# EAGLE design nisetoro_wsc_adapter_v2 (EAGLE 9.6.2)
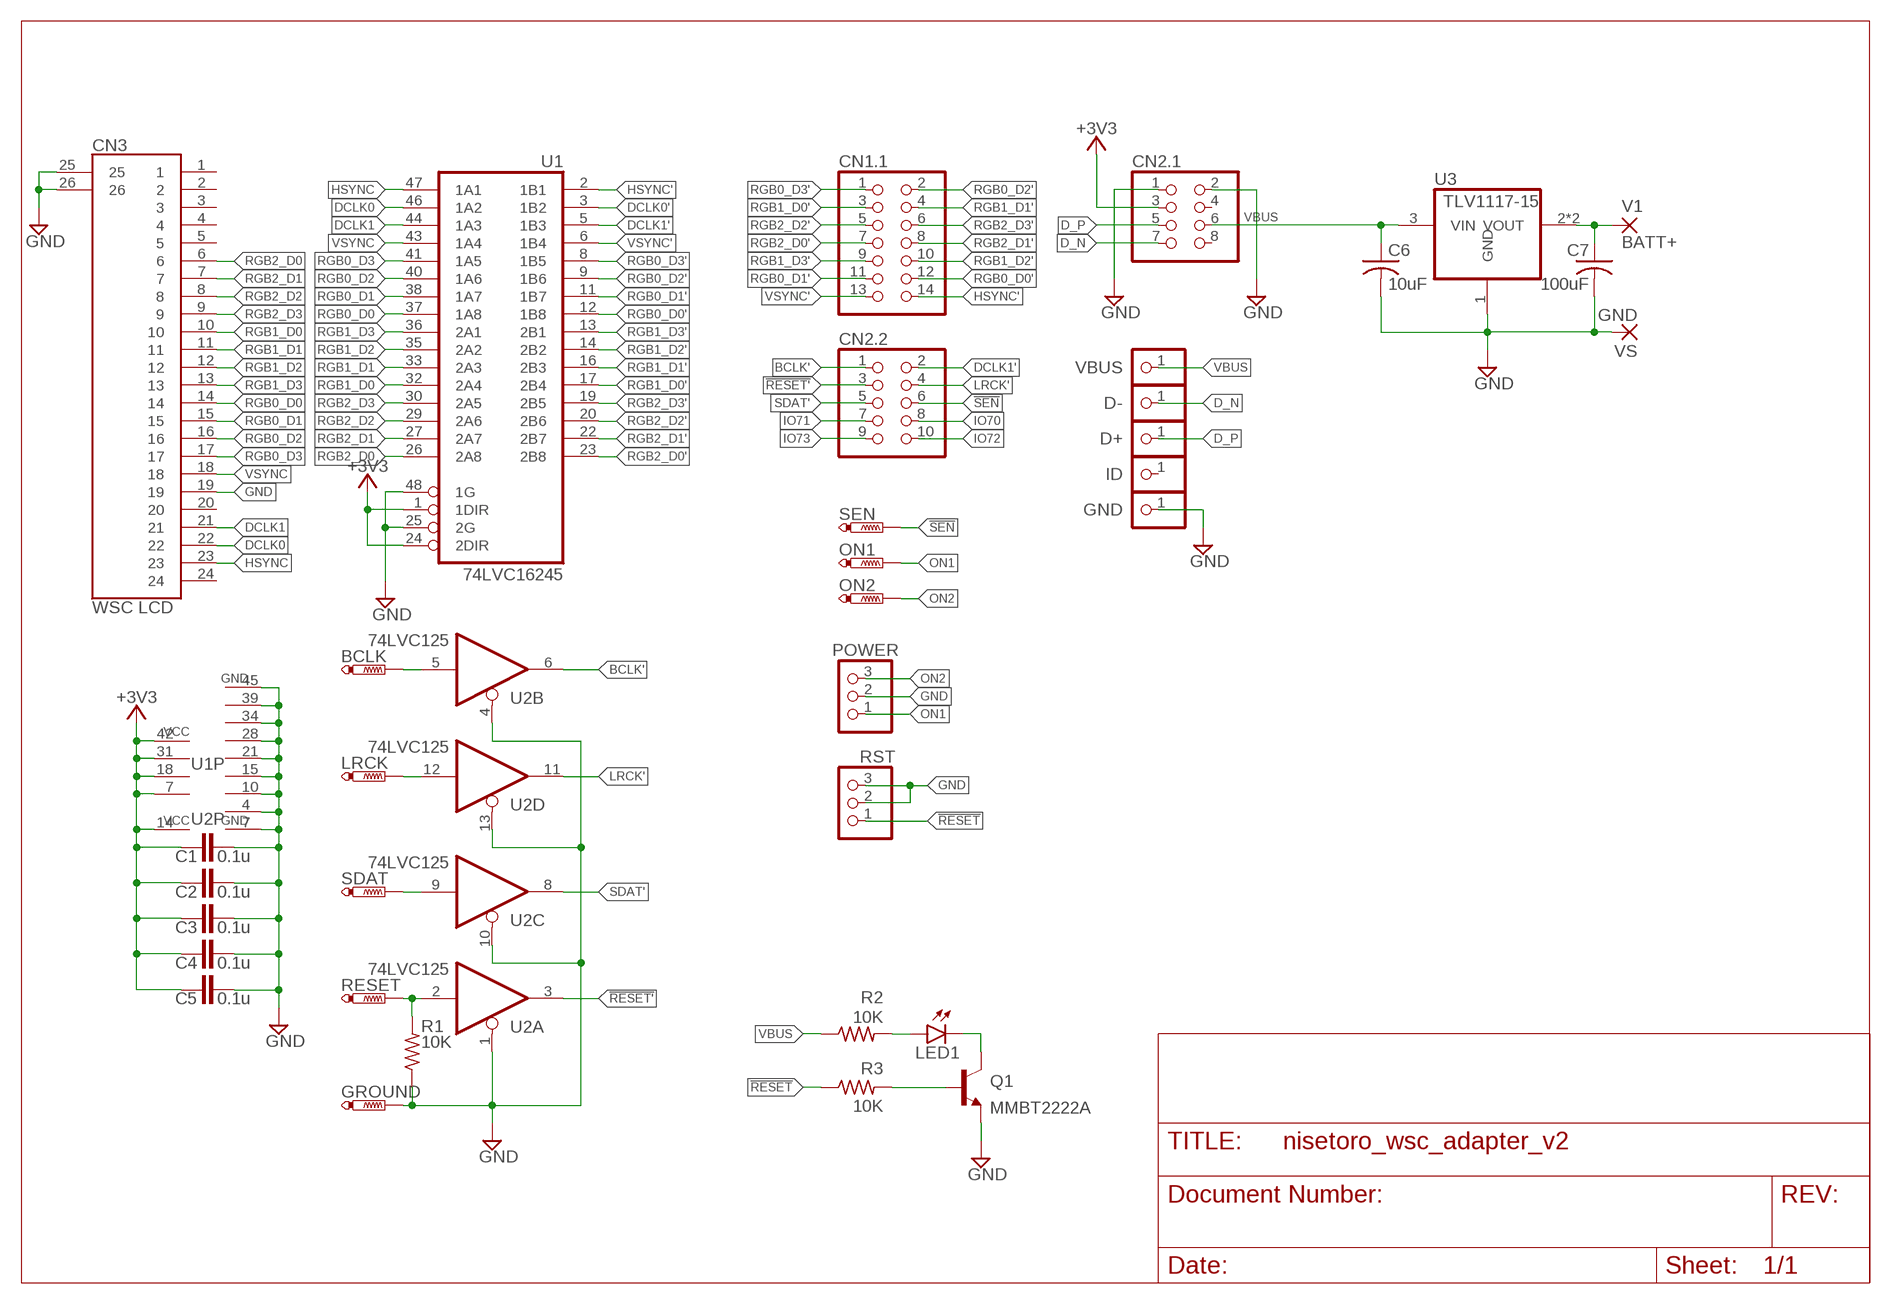
[diagram p0: schematic, sheet 1]

## Parts
BCLK  PTR1B1,27  [B1,27]
C1  0.1u  C-EUC0603  [C0603]
C2  0.1u  C-EUC0603  [C0603]
C3  0.1u  C-EUC0603  [C0603]
C4  0.1u  C-EUC0603  [C0603]
C5  0.1u  C-EUC0603  [C0603]
C6  10uF  C-USC1210  [C1210]
C7  100uF  C-USC1210  [C1210]
CN1.1  PINHD-2X7  [2X07]
CN2.1  PINHD-2X4  [2X04]
CN2.2  PINHD-2X5  [2X05]
CN3  WSC LCD  68712414022/R  [68712414022/R]
D+  PINHD-1X1  [1X01]
D-  PINHD-1X1  [1X01]
GND  PINHD-1X1  [1X01]
GROUND  PTR1B1,27  [B1,27]
ID  PINHD-1X1  [1X01]
LED1  LEDSML0603  [SML0603]
LRCK  PTR1B1,27  [B1,27]
ON1  PTR1B1,27  [B1,27]
ON2  PTR1B1,27  [B1,27]
POWER  PINHD-1X3/ROUND  [1X03/ROUND]
Q1  MMBT2222A  2N2222SOT23  [SOT23-BEC]
R1  10K  R-US_R0603  [R0603]
R2  10K  R-US_R0603  [R0603]
R3  10K  R-US_R0603  [R0603]
RESET  PTR1B1,27  [B1,27]
RST  PINHD-1X3/ROUND  [1X03/ROUND]
SDAT  PTR1B1,27  [B1,27]
SEN  PTR1B1,27  [B1,27]
U1  74LVC16245  74AC16245DGG  [TSSOP48]
U2  74LVC125  74ABT125PW  [TSSOP14]
U3  TLV1117-15  REG1117  [SOT223]
V1  BATT+  WIREPADSMD2,54-5,08  [SMD2,54-5,08]
VBUS  PINHD-1X1  [1X01]
VS  GND  WIREPADSMD2,54-5,08  [SMD2,54-5,08]

## Nets
!RESET: R1.2 R3.1 RESET.TP RST.1 U2.2(A:I)
!RESET': CN2.2.3 U2.3(A:O)
!SEN: CN2.2.6 SEN.TP
+3V3: C1.1 C2.1 C3.1 C4.1 C5.1 CN2.1.3 U1.1(1DIR) U1.7(VCC) U1.18(VCC) U1.24(2DIR) U1.31(VCC) U1.42(VCC) U2.14(P:VCC)
BATT+: C7.1 U3.2(VOUT) U3.4(VOUT) V1.1(P)
BCLK: BCLK.TP U2.5(B:I)
BCLK': CN2.2.1 U2.6(B:O)
D_N: CN2.1.7 D-.1
D_P: CN2.1.5 D+.1
DCLK0: CN3.22 U1.46(1A2)
DCLK0': U1.3(1B2)
DCLK1: CN3.21 U1.44(1A3)
DCLK1': CN2.2.2 U1.5(1B3)
GND: C1.2 C2.2 C3.2 C4.2 C5.2 C6.2 C7.2 CN2.1.1 CN2.1.2 CN3.19 CN3.25 CN3.26 GND.1 GROUND.TP POWER.2 Q1.E R1.1 RST.2 RST.3 U1.4(GND) U1.10(GND) U1.15(GND) U1.21(GND) U1.25(2G) U1.28(GND) U1.34(GND) U1.39(GND) U1.45(GND) U1.48(1G) U2.1(A:OE) U2.4(B:OE) U2.7(P:GND) U2.10(C:OE) U2.13(D:OE) U3.1(GND) VS.1(P)
HSYNC: CN3.23 U1.47(1A1)
HSYNC': CN1.1.14 U1.2(1B1)
IO70: CN2.2.8
IO71: CN2.2.7
IO72: CN2.2.10
IO73: CN2.2.9
LRCK: LRCK.TP U2.12(D:I)
LRCK': CN2.2.4 U2.11(D:O)
N$1: LED1.A R2.2
N$2: LED1.C Q1.C
N$4: Q1.B R3.2
ON1: ON1.TP POWER.1
ON2: ON2.TP POWER.3
RGB0_D0: CN3.14 U1.37(1A8)
RGB0_D0': CN1.1.12 U1.12(1B8)
RGB0_D1: CN3.15 U1.38(1A7)
RGB0_D1': CN1.1.11 U1.11(1B7)
RGB0_D2: CN3.16 U1.40(1A6)
RGB0_D2': CN1.1.2 U1.9(1B6)
RGB0_D3: CN3.17 U1.41(1A5)
RGB0_D3': CN1.1.1 U1.8(1B5)
RGB1_D0: CN3.10 U1.32(2A4)
RGB1_D0': CN1.1.3 U1.17(2B4)
RGB1_D1: CN3.11 U1.33(2A3)
RGB1_D1': CN1.1.4 U1.16(2B3)
RGB1_D2: CN3.12 U1.35(2A2)
RGB1_D2': CN1.1.10 U1.14(2B2)
RGB1_D3: CN3.13 U1.36(2A1)
RGB1_D3': CN1.1.9 U1.13(2B1)
RGB2_D0: CN3.6 U1.26(2A8)
RGB2_D0': CN1.1.7 U1.23(2B8)
RGB2_D1: CN3.7 U1.27(2A7)
RGB2_D1': CN1.1.8 U1.22(2B7)
RGB2_D2: CN3.8 U1.29(2A6)
RGB2_D2': CN1.1.5 U1.20(2B6)
RGB2_D3: CN3.9 U1.30(2A5)
RGB2_D3': CN1.1.6 U1.19(2B5)
SDAT: SDAT.TP U2.9(C:I)
SDAT': CN2.2.5 U2.8(C:O)
VBUS: C6.1 CN2.1.6 R2.1 U3.3(VIN) VBUS.1
VSYNC: CN3.18 U1.43(1A4)
VSYNC': CN1.1.13 U1.6(1B4)
Unconnected: CN2.1.4 CN2.1.8 CN3.1 CN3.2 CN3.3 CN3.4 CN3.5 CN3.20 CN3.24 ID.1

## Library data of the parts
BCLK GROUND LRCK ON1 ON2 RESET SDAT SEN = testpad:PTR1: TEST PIN
C1-C5 = rcl:C-EU: CAPACITOR, European symbol; SPICEPREFIX: C
C6 C7 = rcl:C-US: CAPACITOR, American symbol; SPICEPREFIX: C
CN1.1 = pinhead:PINHD-2X7: PIN HEADER
CN2.1 = pinhead:PINHD-2X4: PIN HEADER
CN2.2 = pinhead:PINHD-2X5: PIN HEADER
CN3 = SamacSys_Parts:68712414022: Wurth Elektronik 687 0.5mm Pitch 24 Way Straight SMT FPC Connector Source: Datasheet <http://katalog.we-online.de/em/datasheet/68712414022.pdf>
D+ D- GND ID VBUS = pinhead:PINHD-1X1: PIN HEADER
LED1 = led:LED: LED OSRAM: - CHIPLED LG R971, LG N971, LY N971, LG Q971, LY Q971, LO R971, LY R971 LH N974, LH R974 LS Q976, LO Q976, LY Q976 LO Q996 - Hyper CHIPLED LW Q18S LB Q993, LB Q99A, LB R99A - SideLED LS A670, LO A670, LY A670, LG A670, LP A670 LB A673, LV A673, LT A673, LW A673 LH A674 LY A675 LS A676, LA A676, LO A676, LY A676, LW A676 LS A679, LY A679, LG A679 - Hyper Micro SIDELED® LS Y876, LA Y876, LO Y876, LY Y876 LT Y87S - SmartLED LW L88C, LW L88S LB L89C, LB L89S, LG L890 LS L89K, LO L89K, LY L89K LS L896, LA L896, LO L896, LY L896 - TOPLED LS T670, LO T670, LY T670, LG T670, LP T670 LSG T670, LSP T670, LSY T670, LOP T670, LYG T670 LG T671, LOG T671, LSG T671 LB T673, LV T673, LT T673, LW T673 LH T674 LS T676, LA T676, LO T676, LY T676, LB T676, LH T676, LSB T676, LW T676 LB T67C, LV T67C, LT T67C, LS T67K, LO T67K, LY T67K, LW E67C LS E67B, LA E67B, LO E67B, LY E67B, LB E67C, LV E67C, LT E67C LW T67C LS T679, LY T679, LG T679 LS T770, LO T770, LY T770, LG T770, LP T770 LB T773, LV T773, LT T773, LW T773 LH T774 LS E675, LA E675, LY E675, LS T675 LS T776, LA T776, LO T776, LY T776, LB T776 LHGB T686 LT T68C, LB T68C - Hyper Mini TOPLED® LB M676 - Mini TOPLED Santana® LG M470 LS M47K, LO M47K, LY M47K Source: http://www.osram.convergy.de LUXEON: - LUMILED® LXK2-PW12-R00, LXK2-PW12-S00, LXK2-PW14-U00, LXK2-PW14-V00 LXK2-PM12-R00, LXK2-PM12-S00, LXK2-PM14-U00 LXK2-PE12-Q00, LXK2-PE12-R00, LXK2-PE12-S00, LXK2-PE14-T00, LXK2-PE14-U00 LXK2-PB12-K00, LXK2-PB12-L00, LXK2-PB12-M00, LXK2-PB14-N00, LXK2-PB14-P00, LXK2-PB14-Q00 LXK2-PR12-L00, LXK2-PR12-M00, LXK2-PR14-Q00, LXK2-PR14-R00 LXK2-PD12-Q00, LXK2-PD12-R00, LXK2-PD12-S00 LXK2-PH12-R00, LXK2-PH12-S00 LXK2-PL12-P00, LXK2-PL12-Q00, LXK2-PL12-R00 Source: www.luxeon.com KINGBRIGHT: KA-3528ASYC Source: www.kingbright.com
POWER RST = pinhead:PINHD-1X3: PIN HEADER
Q1 = transistor-npn:2N2222*: NPN Transistor
R1-R3 = rcl:R-US_: RESISTOR, American symbol; SPICEPREFIX: R
U1 = 74ac-logic:74AC16245: 16-bit BUS TRANSCEIVER, 3-state
U2 = 74xx-eu:74*125: Quad bus BUFFER, 3-state
U3 = burr-brown:REG1117: 800mA and 1A Low Dropout (LDO) Positive Regulator 1.8V, 2.5V, 2.85V, 3.3V, 5V, and Adj; MPN: REG1117; OC_FARNELL: 1097566; OC_NEWARK: 14P6981
V1 VS = wirepad:WIREPAD: Wire PAD connect wire on PCB

## Board
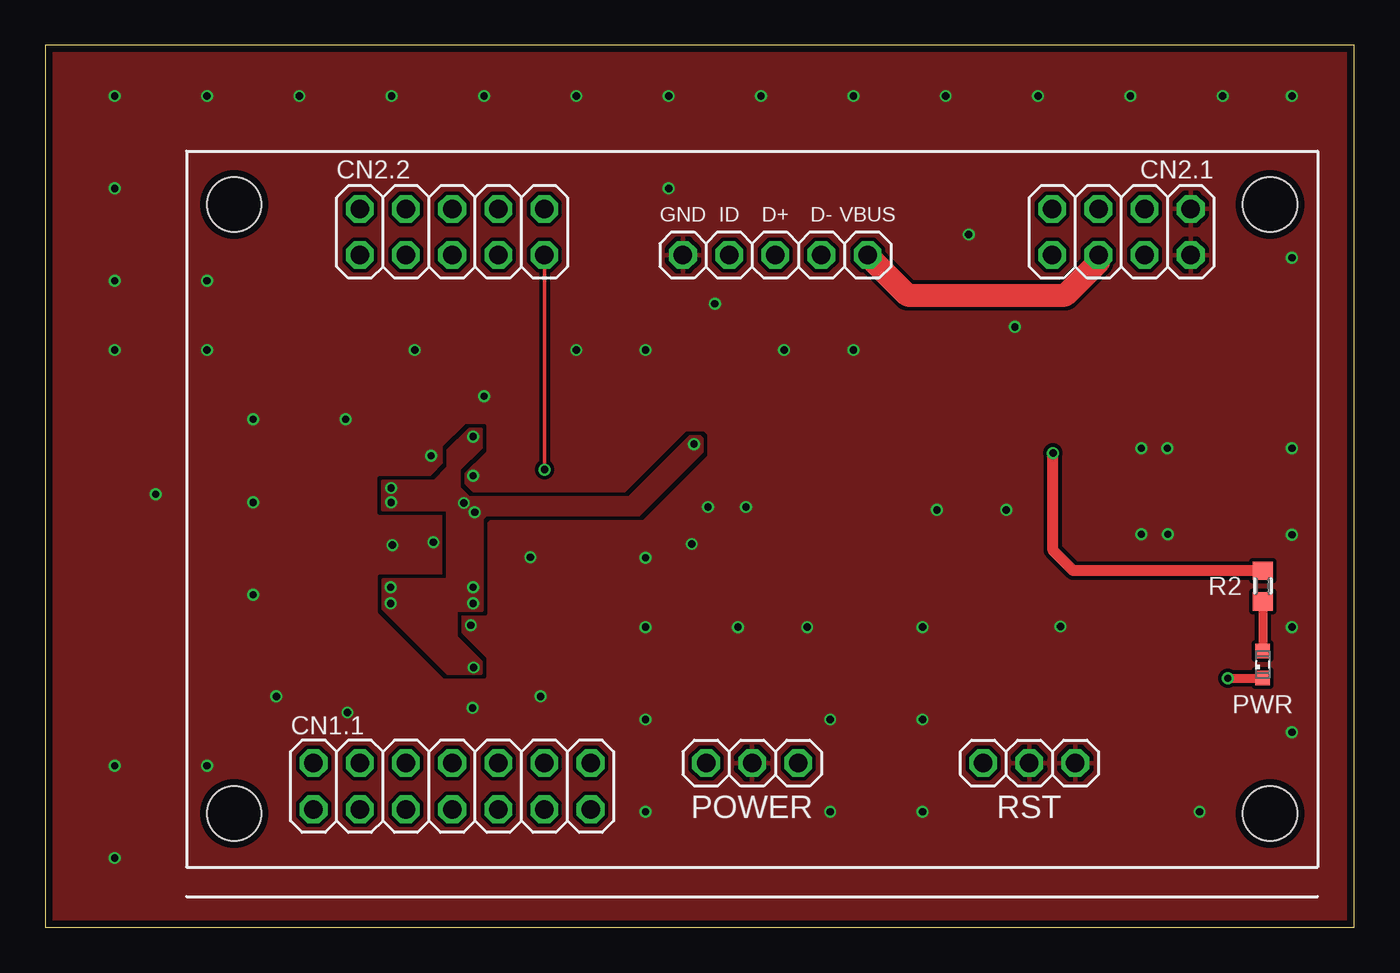
[diagram p1: board, top side]
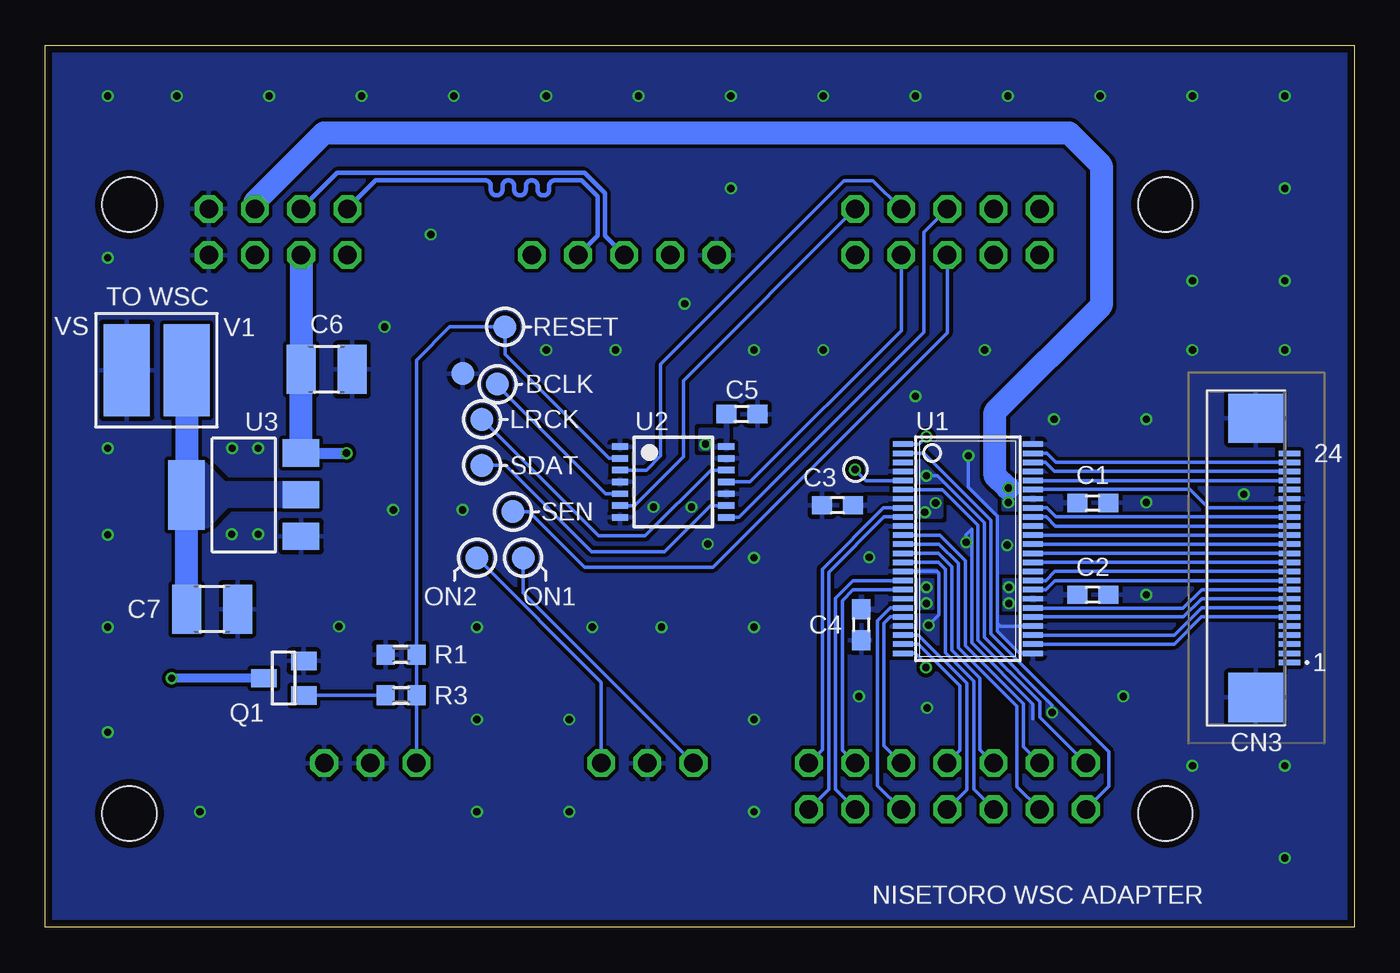
[diagram p2: board, bottom side, seen from below]

Size 72 x 48.5 mm. Coordinates in mm from the lower left corner, seen from the top.
Outline: 0,0 72,0 72,48.5 0,48.5 0,0
Copper layers (1*16): Top 0.035559375mm / dielectric 1.6mm / Bottom 0.035559375mm
Design rules "oshpark-2layer *": minimum track width 6mil, minimum drill 10mil, track to track 6mil, track to pad 6mil, pad to pad 6mil, via to via 6mil, smd to smd 6mil, copper to edge 15mil, drill to drill 6mil, minimum pad ring 5mil, minimum via ring 5mil, stop-mask expansion 2.5mil, vias tented up to drill 15mil, thermal gap 10mil
Holes 3 mm at 10.38,39.75 67.39,39.75 67.39,6.25 10.38,6.25

### Footprints (pad centres in the part's own frame; a part is rotated, then mirrored left to right if it is on the bottom)
B1,27 = smd 1.27 x 1.27: TP 0,0
C0603 = smd 1.1 x 1: 1 -0.85,0; 2 0.85,0
C1210 = smd 1.6 x 2.7: 1 -1.4,0; 2 1.4,0
2X07 = drill 1.016 octagon: 1 -7.62,-1.27; 2 -7.62,1.27; 3 -5.08,-1.27; 4 -5.08,1.27; 5 -2.54,-1.27; 6 -2.54,1.27; 7 0,-1.27; 8 0,1.27; 9 2.54,-1.27; 10 2.54,1.27; 11 5.08,-1.27; 12 5.08,1.27; 13 7.62,-1.27; 14 7.62,1.27
2X04 = drill 1.016 octagon: 1 -3.81,-1.27; 2 -3.81,1.27; 3 -1.27,-1.27; 4 -1.27,1.27; 5 1.27,-1.27; 6 1.27,1.27; 7 3.81,-1.27; 8 3.81,1.27
2X05 = drill 1.016 octagon: 1 -5.08,-1.27; 2 -5.08,1.27; 3 -2.54,-1.27; 4 -2.54,1.27; 5 0,-1.27; 6 0,1.27; 7 2.54,-1.27; 8 2.54,1.27; 9 5.08,-1.27; 10 5.08,1.27
68712414022/R = smd 0.3 x 1.2: 1 5.75,1.825; 2 5.25,1.825; 3 4.75,1.825; 4 4.25,1.825; 5 3.75,1.825; 6 3.25,1.825; 7 2.75,1.825; 8 2.25,1.825; 9 1.75,1.825; 10 1.25,1.825; 11 0.75,1.825; 12 0.25,1.825; 13 -0.25,1.825; 14 -0.75,1.825; 15 -1.25,1.825; 16 -1.75,1.825; 17 -2.25,1.825; 18 -2.75,1.825; 19 -3.25,1.825; 20 -3.75,1.825; 21 -4.25,1.825; 22 -4.75,1.825; 23 -5.25,1.825; 24 -5.75,1.825 | smd 2.7 x 3: 25 -7.68,-0.035; 26 7.68,-0.035
1X01 = drill 1.016 octagon: 1 0,0
SML0603 = smd 0.8 x 0.8: A 0.75,0; C -0.75,0
1X03/ROUND = drill 1.016 octagon: 1 -2.54,0; 2 0,0; 3 2.54,0
SOT23-BEC = smd 1 x 1.4: B -0.95,-1.1; C 0,1.1; E 0.95,-1.1
R0603 = smd 1 x 1.1: 1 -0.85,0; 2 0.85,0
TSSOP48 = smd 0.3 x 1.1: 1 -5.75,-3.575; 2 -5.25,-3.575; 3 -4.75,-3.575; 4 -4.25,-3.575; 5 -3.75,-3.575; 6 -3.25,-3.575; 7 -2.75,-3.575; 8 -2.25,-3.575; 9 -1.75,-3.575; 10 -1.25,-3.575; 11 -0.75,-3.575; 12 -0.25,-3.575; 13 0.25,-3.575; 14 0.75,-3.575; 15 1.25,-3.575; 16 1.75,-3.575; 17 2.25,-3.575; 18 2.75,-3.575; 19 3.25,-3.575; 20 3.75,-3.575; 21 4.25,-3.575; 22 4.75,-3.575; 23 5.25,-3.575; 24 5.75,-3.575; 25 5.75,3.575; 26 5.25,3.575; 27 4.75,3.575; 28 4.25,3.575; 29 3.75,3.575; 30 3.25,3.575; 31 2.75,3.575; 32 2.25,3.575; 33 1.75,3.575; 34 1.25,3.575; 35 0.75,3.575; 36 0.25,3.575; 37 -0.25,3.575; 38 -0.75,3.575; 39 -1.25,3.575; 40 -1.75,3.575; 41 -2.25,3.575; 42 -2.75,3.575; 43 -3.25,3.575; 44 -3.75,3.575; 45 -4.25,3.575; 46 -4.75,3.575; 47 -5.25,3.575; 48 -5.75,3.575
TSSOP14 = smd 0.35 x 0.9: 1 -1.95,-2.925; 2 -1.3,-2.925; 3 -0.65,-2.925; 4 0,-2.925; 5 0.65,-2.925; 6 1.3,-2.925; 7 1.95,-2.925; 8 1.95,2.925; 9 1.3,2.925; 10 0.65,2.925; 11 0,2.925; 12 -0.65,2.925; 13 -1.3,2.925; 14 -1.95,2.925
SOT223 = smd 1.499 x 2.007: 1 -2.261,-3.15; 2 0.025,-3.15; 3 2.311,-3.15 | smd 3.81 x 2.007: 4 0,3.15
SMD2,54-5,08 = smd 2.54 x 5.08: 1 0,0

### Placement (x,y rotation side)
BCLK  47.13,29.88 0 bottom
C1  14.38,23.34 0 bottom
C2  14.38,18.29 0 bottom
C3  28.42,23.21 180 bottom
C4  27.11,16.64 270 bottom
C5  33.69,28.23 0 bottom
C6  56.53,30.69 0 bottom
C7  62.83,17.5 0 bottom
CN1.1  22.38,7.76 180 top
CN2.1  59.2,38.24 180 top
CN2.2  22.38,38.24 180 top
CN3  5.38,20.32 270 bottom
D+  40.16,36.97 0 top
D-  42.7,36.97 0 top
GND  35.08,36.97 0 top
GROUND  49.04,30.45 0 bottom
ID  37.62,36.97 0 top
LED1  66.98,14.45 90 top
LRCK  47.99,27.94 0 bottom
ON1  45.72,20.32 0 bottom
ON2  48.26,20.32 0 bottom
POWER  38.88,9.03 0 top
Q1  58.89,13.7 90 bottom
R1  52.44,15 0 bottom
R2  66.98,18.76 270 top
R3  52.44,12.75 180 bottom
RESET  46.72,33.02 0 bottom
RST  54.12,9.03 0 top
SDAT  47.99,25.4 0 bottom
SEN  46.28,22.86 0 bottom
U1  21.25,20.82 270 bottom
U2  37.46,24.49 270 bottom
U3  61.08,23.77 90 bottom
V1  64.23,30.64 0 bottom
VBUS  45.23,36.97 0 top
VS  67.53,30.64 0 bottom

### Tracks (layer width: path | path; a pad name or v marks a point on that pad's centre or on a via)
!RESET
  Bottom 0.2: U2.2 41,25.79 46.72,31.51 RESET.TP 49.75,33.02 51.59,31.19 R1.2 R3.1 RST.1
!RESET'
  Bottom 0.2: CN2.2.3 26.46,41.05 28.07,41.05 38.15,30.97 38.15,25.92 38.93,25.14 U2.3
!SEN
  Bottom 0.2: SEN.TP 45.39,22.86 42.34,19.81 35.26,19.81 22.38,32.7 CN2.2.6
+3V3  (via drill 0.4)
  Bottom 0.2: U1.1 23.94,26.57 v23.53,26.99 | U1.24 24.15,15.07 23.56,14.48 v23.56,14.29
  Bottom 1.27: CN2.1.3 60.48,39.89 56.68,43.69 15.68,43.69 13.91,41.91 13.91,34.2 19.75,28.35 19.75,24.83 19.08,24.16 v19.02,24.16
  other vias: 19.02,23.37 18.99,17.81 18.99,18.7 23.62,22.83 23.02,23.34 23.53,18.7 23.53,17.81 35.69,26.57
  pour Bottom: 15.37,24.51 19.27,24.51 19.27,23.02 15.37,23.02
  pour Bottom: 15.68,19.05 15.68,17.53 19.27,17.53 19.27,19.05
  pour Bottom: 24.38,23.62 22.76,23.62 22.76,22.61 24.38,22.61
  pour Bottom: 24.32,19.05 24.32,17.59 23.21,17.59 23.21,19.05
  pour Bottom: 25.18,23.59 27.3,23.59 27.3,22.89 25.18,22.89
  pour Bottom: 25.24,18.16 27.5,18.16 27.5,17.08 25.24,17.08
  pour Bottom: 34.51,27.75 34.92,27.75 34.92,27.34 35.94,27.34 35.94,26.32 34.51,26.32
  pour Top: 18.54,24.54 18.54,22.96 22.13,22.96 22.13,19.11 18.57,19.11 18.57,17.53 22.13,13.97 23.97,13.97 23.97,14.61 22.61,15.97 22.61,17.43 24.03,17.43 24.03,22.48 24.26,22.7 32.67,22.7 36.13,26.16 36.13,26.86 36,26.99 35.46,26.99 32.1,23.62 23.3,23.62 22.76,24.16 22.76,25.18 23.97,26.38 23.97,27.4 23.34,27.4 22.16,26.23 22.16,25.3 21.4,24.54
BATT+
  Bottom 1.27: C7.1 U3.4 V1.1
  pour Bottom (no thermals): 57.48,23.15 61.98,23.15 63.09,22.03 63.37,22.03 63.37,25.5 63.18,25.5 62.13,24.45 58.78,24.45
BCLK
  Bottom 0.2: U2.5 41.19,23.84 47.13,29.78 BCLK.TP
BCLK'
  Bottom 0.2: CN2.2.1 36.89,30.07 36.89,25.88 39.58,23.19 U2.6
D_N
  Bottom 0.254: D-.1 41.63,38.04 41.63,40.2 42.51,41.08 43.97,41.08 arc-90 44.28,40.77 44.28,40.57 arc90 44.6,40.25 44.61,40.25 arc90 44.93,40.57 44.93,40.77 arc-90 45.24,41.08 45.25,41.08 arc-90 45.57,40.77 45.57,40.57 arc90 45.89,40.25 45.9,40.25 arc90 46.21,40.57 46.21,40.77 arc-90 46.53,41.08 46.54,41.08 arc-90 46.85,40.77 46.85,40.57 arc90 47.17,40.25 47.18,40.25 arc90 47.5,40.57 47.5,40.77 arc-90 47.82,41.08 53.82,41.08 CN2.1.7
D_P
  Bottom 0.254: D+.1 41.22,38.04 41.22,40.37 42.34,41.49 55.95,41.49 CN2.1.5
DCLK0
  Bottom 0.2: CN3.22 16.5,25.07 17,25.57 U1.46
DCLK1
  Bottom 0.2: CN3.21 U1.44
DCLK1'  (via drill 0.4)
  Top 0.2: CN2.2.2 v27.45,25.17
  Bottom 0.2: v27.45,25.17 26.85,24.57 U1.5
GND  (via drill 0.4)
  Bottom 0.2: v21.22,25.94 21.22,24.19 19.63,22.6 19.63,16.73 | v16.61,11.81 16.61,12.22 20.33,15.95 20.33,22.25 22.91,24.83 v23.53,24.83 | v21.34,21.18 21.34,21.59 21.04,21.89 21.04,15.64 17.67,12.27 17.67,11.46 | v23.41,16.61 22.83,17.18 22.83,19.46 22.94,19.57 U1.15 | 19.63,16.73 19.47,16.57 U1.28 | 19.63,16.73 19.63,16.29 18.41,15.07 U1.25
  other vias: 23.5,12.06 11.43,18.29 11.43,23.37 19.09,21.02 26.68,20.35 27.24,12.7 3.81,3.81 3.81,8.89 8.89,8.89 12.7,12.7 3.81,31.75 3.81,35.56 3.81,40.64 3.81,45.72 8.89,45.72 13.97,45.72 19.05,45.72 24.13,45.72 29.21,45.72 34.29,45.72 39.37,45.72 44.45,45.72 49.53,45.72 54.61,45.72 59.69,45.72 64.77,45.72 68.58,45.72 8.89,35.56 8.89,31.75 68.58,36.83 68.58,26.35 68.58,21.59 68.58,16.51 68.58,10.73 16.51,27.94 20.32,31.75 29.21,31.75 33.02,31.75 11.43,27.94 33.02,20.32 33.02,16.51 33.02,11.43 33.02,6.35 38.1,16.51 48.26,6.35 41.91,16.51 48.26,16.51 48.26,11.43 63.5,6.35 44.45,31.75 36.83,34.29 53.34,33.02 61.72,26.35 60.29,21.62 50.8,38.1 34.29,40.64 38.54,23.11 40.64,31.75 60.29,26.35 61.75,21.62 55.85,16.54 52.86,22.96 24.13,29.21 43.18,11.43 43.18,6.35 49.05,22.96 6.06,23.81 36.45,23.11 35.56,21.08
  pour Top (isolate 0.2, rank 6): -1.27,49.53 73.66,49.53 73.66,-1.27 -1.27,-1.27
  pour Bottom (isolate 0.2, rank 6): -1.27,49.53 73.66,49.53 73.66,-1.27 -1.27,-1.27
HSYNC
  Bottom 0.2: CN3.23 16.4,25.57 16.9,26.07 U1.47
HSYNC'
  Bottom 0.2: CN1.1.14 13.49,7.75 13.49,9.65 19.98,16.14 19.98,22.39 23.66,26.07 U1.2
LRCK
  Bottom 0.2: LRCK.TP 41.58,21.53 39.01,21.53 35.39,25.14 U2.12
LRCK'
  Bottom 0.2: U2.11 33.23,24.49 24.91,32.81 CN2.2.4
N$1
  Top 0.508: R2.2 LED1.A
N$2  (via drill 0.4)
  Top 0.508: v65.06,13.7 LED1.C
  Bottom 0.508: Q1.C v65.06,13.7
N$4
  Bottom 0.2: R3.2 Q1.B
ON1
  Bottom 0.2: ON1.TP 45.72,18.41 POWER.1
ON2
  Bottom 0.2: POWER.3 41.42,13.48 ON2.TP
RGB0_D0
  Bottom 0.2: CN3.14 U1.37
RGB0_D0'
  Bottom 0.2: CN1.1.12 18.54,7.74 18.54,12.15 21.77,15.38 21.77,20.02 22.83,21.07 U1.12
RGB0_D1
  Bottom 0.2: CN3.15 U1.38
RGB0_D1'
  Bottom 0.2: CN1.1.11 18.19,9.93 18.19,12.29 21.39,15.49 21.39,20.16 22.8,21.57 U1.11
RGB0_D2
  Bottom 0.2: CN3.16 16.43,22.07 16.93,22.57 U1.40
RGB0_D2'
  Bottom 0.2: CN1.1.2 28.9,7.59 28.9,19.53 25.86,22.57 U1.9
RGB0_D3
  Bottom 0.2: CN3.17 16.41,22.57 16.91,23.07 U1.41
RGB0_D3'
  Bottom 0.2: CN1.1.1 29.25,9.77 29.25,19.7 25.89,23.07 U1.8
RGB1_D0
  Bottom 0.2: CN3.10 16.46,19.07 16.96,18.57 U1.32
RGB1_D0'
  Bottom 0.2: CN1.1.3 28.16,9.74 28.16,17.97 27.56,18.57 U1.17
RGB1_D1
  Bottom 0.2: CN3.11 16.47,19.57 16.97,19.07 U1.33
RGB1_D1'
  Bottom 0.2: CN1.1.4 28.55,7.58 28.55,18.09 27.56,19.07 U1.16
RGB1_D2
  Bottom 0.2: CN3.12 U1.35
RGB1_D2'
  Bottom 0.2: CN1.1.10 20.93,7.58 20.93,13.54 22.48,15.09 22.48,19.69 22.86,20.07 U1.14
RGB1_D3
  Bottom 0.2: CN3.13 U1.36
RGB1_D3'
  Bottom 0.2: CN1.1.9 20.58,9.77 20.58,13.68 22.13,15.23 22.13,19.84 22.86,20.57 U1.13
RGB2_D0
  Bottom 0.2: CN3.6 8.39,17.07 9.89,15.57 U1.26
RGB2_D0'
  Bottom 0.2: CN1.1.7 21.68,9.73 21.68,13.29 23.96,15.57 U1.23
RGB2_D1
  Bottom 0.2: CN3.7 8.39,17.57 9.89,16.07 U1.27
RGB2_D1'
  Bottom 0.2: CN1.1.8 21.3,7.56 21.3,13.41 23.96,16.07 U1.22
RGB2_D2
  Bottom 0.2: CN3.8 8.39,18.07 9.39,17.07 U1.29
RGB2_D2'
  Bottom 0.2: CN1.1.5 25.86,9.97 25.86,16.72 25.51,17.07 U1.20
RGB2_D3
  Bottom 0.2: CN3.9 8.39,18.57 9.42,17.54 17.16,17.54 17.19,17.57 U1.30
RGB2_D3'
  Bottom 0.2: CN1.1.6 26.21,7.79 26.21,16.86 25.5,17.57 U1.19
SDAT
  Bottom 0.2: U2.9 35.41,23.19 37.94,20.67 41.95,20.67 46.68,25.4 SDAT.TP
SDAT'
  Bottom 0.2: U2.8 33.83,22.54 23.65,32.72 23.65,38.23 CN2.2.5
VBUS  (via drill 0.4)
  Top 0.61: R2.1 56.55,19.61 55.44,20.73 v55.44,26.08
  Top 1.27: VBUS.1 47.44,34.77 56.11,34.77 57.94,36.59 CN2.1.6
  Bottom 0.61: U3.3 v55.44,26.08
  Bottom 1.27: U3.3 C6.1 CN2.1.6
VSYNC
  Bottom 0.2: CN3.18 8.02,23.07 9.04,24.09 17.19,24.09 17.21,24.07 U1.43
VSYNC'
  Bottom 0.2: CN1.1.13 17.29,11.56 17.29,12.4 20.69,15.8 20.69,22.1 22.66,24.07 U1.6

### Text on the board
tPlace: PWR
bPlace: TO WSC | 24 | 1 | NISETORO WSC ADAPTER